# Altium schematic sheet TheStaticTurtle_oshw-sdi3g-fiber__schematic_V4-Normal_OSHW_BiDi_SDI_Fiber_Converter_V4_Normal_2024-11-17__SDI.schdoc
size 699 x 194 mm
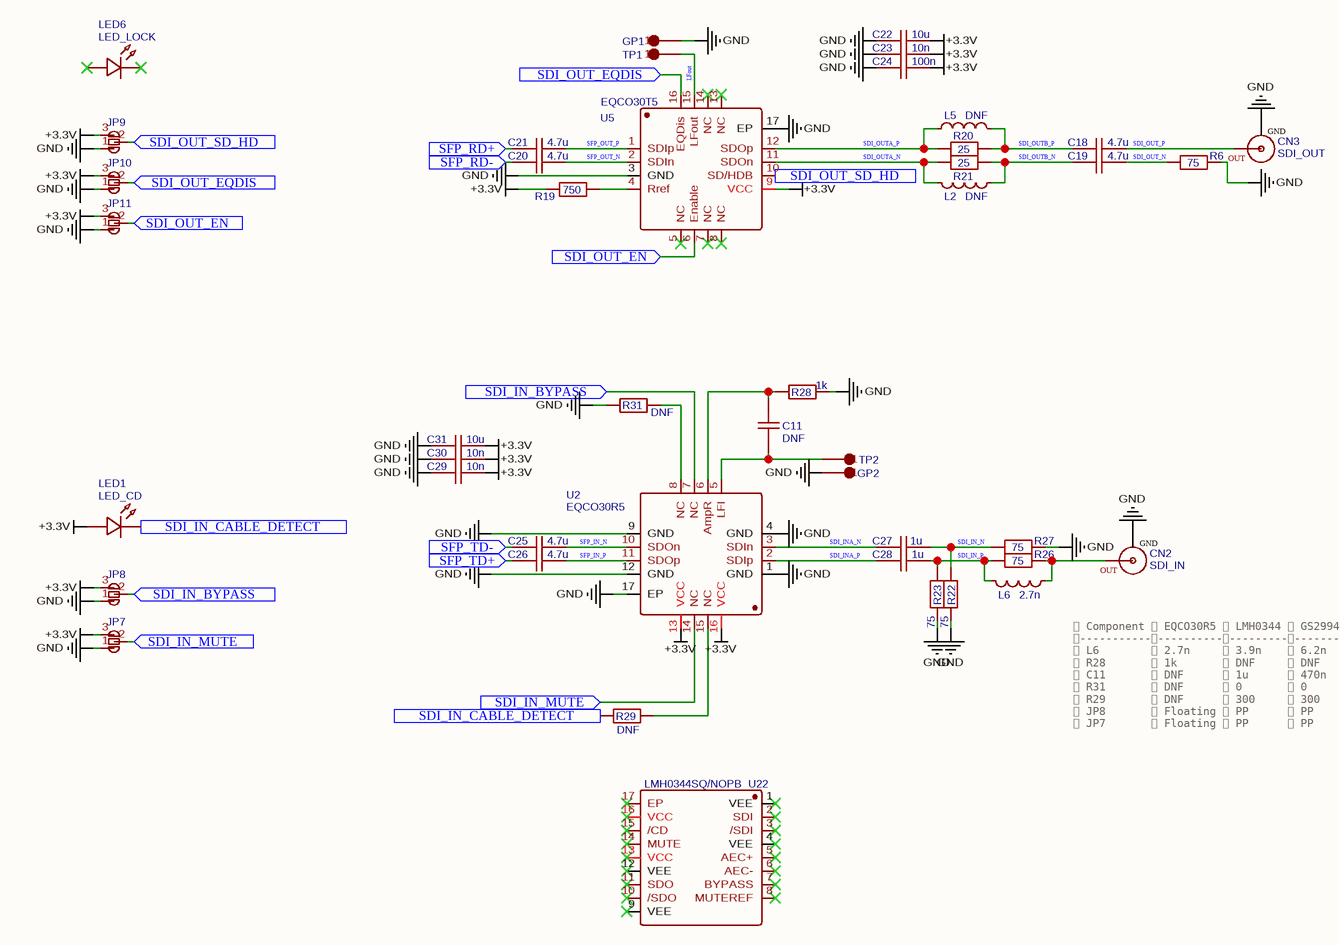
[diagram p0: TheStaticTurtle_oshw-sdi3g-fiber__schematic_V4-Normal_OSHW_BiDi_SDI_Fiber_Converter_V4_Normal_2024-11-17__SDI.schdoc]

## Parts
C11  DNF  [C0603]
C18  4.7u  [C0603]
C19  4.7u  [C0603]
C20  4.7u  [C0603]
C21  4.7u  [C0603]
C22  10u  [C0603]
C23  10n  [C0603]
C24  100n  [C0603]
C25  4.7u  [C0603]
C26  4.7u  [C0603]
C27  1u  [C0603]
C28  1u  [C0603]
C29  10n  [C0603]
C30  10n  [C0603]
C31  10u  [C0603]
CN2  SDI_IN  [AMPHENOLRF_034-1030-12G]
CN3  SDI_OUT  [AMPHENOLRF_034-1030-12G]
GP1  TEST-POINT-PTH-1X1  [TESTPOINT-SMD_L1.6-W0.8_RCU-0C]  (value not drawn)
GP2  TEST-POINT-PTH-1X1  [TESTPOINT-SMD_L1.6-W0.8_RCU-0C]  (value not drawn)
JP7  SOLDER BRIDGE 3P  [SOLDER BRIDGE 3P]  (value not drawn)
JP8  SOLDER BRIDGE 3P  [SOLDER BRIDGE 3P]  (value not drawn)
JP9  SOLDER BRIDGE 3P  [SOLDER BRIDGE 3P]  (value not drawn)
JP10  SOLDER BRIDGE 3P  [SOLDER BRIDGE 3P]  (value not drawn)
JP11  SOLDER BRIDGE 3P  [SOLDER BRIDGE 3P]  (value not drawn)
L2  DNF  [L0603]
L5  DNF  [L0603]
L6  2.7n  [L0603]
LED1  LED_CD  [LED0805_GREEN]
LED6  LED_LOCK  [LED0805_GREEN]
R6  75  [R0603]
R19  750  [R0603]
R20  25  [R0603]
R21  25  [R0603]
R22  75  [R0603]
R23  75  [R0603]
R26  75  [R0603]
R27  75  [R0603]
R28  1k  [R0603]
R29  DNF  [R0603]
R31  DNF  [R0603]
TP1  TEST-POINT-PTH-1X1  [TESTPOINT-SMD_L1.6-W0.8_RCU-0C]  (value not drawn)
TP2  TEST-POINT-PTH-1X1  [TESTPOINT-SMD_L1.6-W0.8_RCU-0C]  (value not drawn)
U2  EQCO30R5  [QFN16G-0.65-4X4MM]
U5  EQCO30T5  [QFN16G-0.65-4X4MM]
U22  LMH0344SQ/NOPB  [QFN-16_L4.0-W4.0-P0.65-BL-EP2.6]

## Ports
SDI_IN_BYPASS (in), SDI_IN_CABLE_DETECT (in), SDI_IN_MUTE (in), SDI_OUT_EN (in), SDI_OUT_EQDIS (in), SDI_OUT_SD_HD (in), SFP_RD+ (in), SFP_RD- (in), SFP_TD+ (in), SFP_TD- (in)

## Nets
+3.3V: C22.2 C23.2 C24.2 C29.2 C30.2 C31.2 JP7.3(B) JP8.3(B) JP9.3(B) JP10.3(B) JP11.3(B) LED1.1 R19.1 U2.13(VCC) U2.16(VCC) U5.9(VCC)
GND: C22.1 C23.1 C24.1 C29.1 C30.1 C31.1 CN2.GND CN3.GND GP1.1 GP2.1 JP7.1(A) JP8.1(A) JP9.1(A) JP10.1(A) JP11.1(A) R6.2 R22.1 R23.1 R27.2 R28.1 R31.2 U2.1(GND) U2.4(GND) U2.9(GND) U2.12(GND) U2.17(EP) U5.3(GND) U5.17(EP)
LFout: TP1.1 U5.15(LFout)
SDI_IN_BYPASS: JP8.2(B) U2.7(NC) ; port SDI_IN_BYPASS
SDI_IN_CABLE_DETECT: LED1.2 R29.2 ; port SDI_IN_CABLE_DETECT
SDI_IN_MUTE: JP7.2(B) U2.14(NC) ; port SDI_IN_MUTE
SDI_IN_N: C27.2 R22.2 R27.1
SDI_IN_P: C28.2 L6.2 R23.2 R26.1
SDI_INA_N: C27.1 U2.3(SDIn)
SDI_INA_P: C28.1 U2.2(SDIp)
SDI_OUT_EN: JP11.2(B) U5.6(Enable) ; port SDI_OUT_EN
SDI_OUT_EQDIS: JP10.2(B) U5.16(EQDis) ; port SDI_OUT_EQDIS
SDI_OUT_N: C19.2 R6.1
SDI_OUT_P: C18.2 CN3.1(OUT)
SDI_OUT_SD_HD: JP9.2(B) U5.10(SD/HDB) ; port SDI_OUT_SD_HD
SDI_OUTA_N: L2.2 R21.1 U5.11(SDOn)
SDI_OUTA_P: L5.1 R20.1 U5.12(SDOp)
SDI_OUTB_N: C19.1 L2.1 R21.2
SDI_OUTB_P: C18.1 L5.2 R20.2
SFP_IN_N: C25.2 U2.10(SDOn)
SFP_IN_P: C26.2 U2.11(SDOp)
SFP_OUT_N: C20.2 U5.2(SDIn)
SFP_OUT_P: C21.2 U5.1(SDIp)
SFP_RD+: C21.1 ; port SFP_RD+
SFP_RD-: C20.1 ; port SFP_RD-
SFP_TD+: C26.1 ; port SFP_TD+
SFP_TD-: C25.1 ; port SFP_TD-
NetC11_1: C11.1 TP2.1 U2.5(LFI)
NetC11_2: C11.2 R28.2 U2.6(AmpR)
NetCN2_1: CN2.1(OUT) L6.1 R26.2
NetR19_2: R19.2 U5.4(Rref)
NetR29_1: R29.1 U2.15(NC)
NetR31_1: R31.1 U2.8(NC)

Not connected (* = marked no-connect by the designer): LED6 1* 2*; U5 5(NC)* 7(NC)* 8(NC)* 13(NC)* 14(NC)*; U22 1(VEE)* 2(SDI)* 3(/SDI)* 4(VEE)* 5(AEC+)* 6(AEC-)* 7(BYPASS)* 8(MUTEREF)* 9(VEE)* 10(/SDO)* 11(SDO)* 12(VEE)* 13(VCC)* 14(MUTE)* 15(/CD)* 16(VCC)* 17(EP)*

## Notes on the sheet
-  Component  EQCO30R5  LMH0344  GS2994 
  --------------------------------------
   L6         2.7n      3.9n     6.2n   
   R28        1k        DNF      DNF    
   C11        DNF       1u       470n   
   R31        DNF       0        0      
   R29        DNF       300      300    
   JP8        Floating  PP       PP     
   JP7        Floating  PP       PP     

## Library data of the parts
C11 = DNF: nameAlias: Value(F); Contributor: LCEDA_Lib; spicePre: C; spiceSymbolName: C_0603_US
C18-C21 C25 C26 = 4.7u: nameAlias: Value(F); Contributor: LCEDA_Lib; spicePre: C; spiceSymbolName: C_0603_US
C22 C31 = 10u: nameAlias: Value(F); Contributor: LCEDA_Lib; spicePre: C; spiceSymbolName: C_0603_US
C23 C29 C30 = 10n: nameAlias: Value(F); Contributor: LCEDA_Lib; spicePre: C; spiceSymbolName: C_0603_US
C24 = 100n: nameAlias: Value(F); Contributor: LCEDA_Lib; spicePre: C; spiceSymbolName: C_0603_US
C27 C28 = 1u: nameAlias: Value(F); Contributor: LCEDA_Lib; spicePre: C; spiceSymbolName: C_0603_US
JP7-JP11 = SOLDER BRIDGE 3P: Contributor: TheStaticTurtle; spicePre: U; spiceSymbolName: SOLDER BRIDGE 3P
L2 L5 = DNF: nameAlias: Value(H); Contributor: LCEDA_Lib; spicePre: L; spiceSymbolName: L0603_US
L6 = 2.7n: nameAlias: Value(H); Contributor: LCEDA_Lib; spicePre: L; spiceSymbolName: L0603_US
LED1 = LED_CD: Manufacturer: 国星光电; Manufacturer Part: NCD0805G1; Contributor: LCEDA_Lib; Supplier Part: C84260; spicePre: L; spiceSymbolName: LED-0805_G
LED6 = LED_LOCK: Manufacturer: 国星光电; Manufacturer Part: NCD0805G1; Contributor: LCEDA_Lib; Supplier Part: C84260; spicePre: L; spiceSymbolName: LED-0805_G
R6 R22 R23 R26 R27 = 75: nameAlias: Value(Ω); Contributor: LCEDA_Lib; spicePre: R; spiceSymbolName: R_0603_EU
R19 = 750: nameAlias: Value(Ω); Contributor: LCEDA_Lib; spicePre: R; spiceSymbolName: R_0603_EU
R20 R21 = 25: nameAlias: Value(Ω); Contributor: LCEDA_Lib; spicePre: R; spiceSymbolName: R_0603_EU
R28 = 1k: nameAlias: Value(Ω); Contributor: LCEDA_Lib; spicePre: R; spiceSymbolName: R_0603_EU
R29 R31 = DNF: nameAlias: Value(Ω); Contributor: LCEDA_Lib; spicePre: R; spiceSymbolName: R_0603_EU
U2 = EQCO30R5: Manufacturer: Microchip; Contributor: turtleforgaming; Manufacturer Part: EQCO30R5; link: https://www.microchip.com/en-us/product/eqco30r5; spicePre: U; spiceSymbolName: EQCO30R5
U5 = EQCO30T5: Manufacturer: Microchip; Contributor: turtleforgaming; Manufacturer Part: EQCO30T5; link: https://www.microchip.com/en-us/product/eqco30r5; spicePre: U; spiceSymbolName: EQCO30T5
U22 = LMH0344SQ/NOPB: Manufacturer: TI(德州仪器); Contributor: LCSC; Supplier: LCSC; Supplier Part: C191792; Manufacturer Part: LMH0344SQ/NOPB; JLCPCB Part Class: Extended Part; spicePre: U; spiceSymbolName: LMH0344SQ/NOPB
CN2 = SDI_IN: Supplier Part: 523-34-1030-12G; Supplier: Mouser; spicePre: C; spiceSymbolName: AMPHENOL RF - 034-1030-12G MINI BNC
CN3 = SDI_OUT: Supplier Part: 523-34-1030-12G; Supplier: Mouser; spicePre: C; spiceSymbolName: AMPHENOL RF - 034-1030-12G MINI BNC
GP1 GP2 TP1 TP2 = TEST-POINT-PTH-1X1: spicePre: T; spiceSymbolName: TEST-POINT-PTH-1X1